# EAGLE design iv4_6lw_1.0 (EAGLE 5.07)
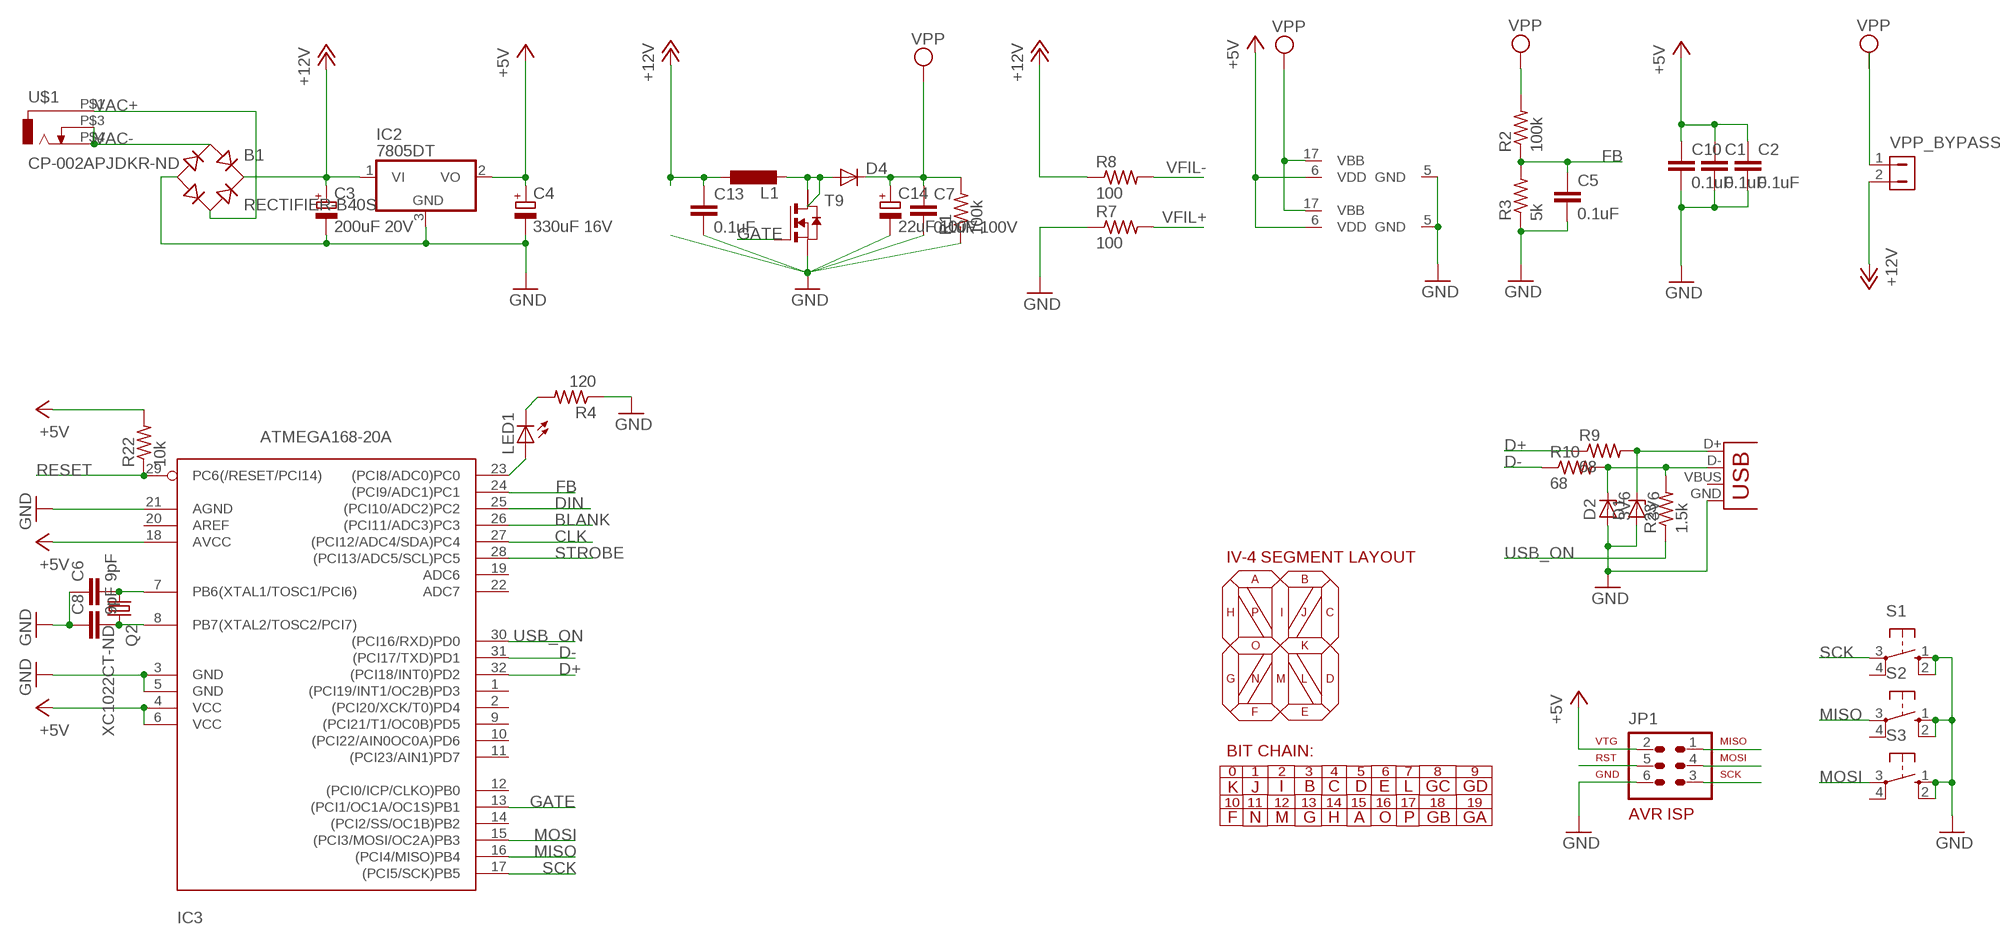
[diagram p0: schematic, sheet 1]

## Parts
B1  RECTIFIER-B40S  [B40S]
C1  0.1uF  C-EUC0805  [C0805]
C2  0.1uF  C-EUC0805  [C0805]
C3  200uF 20V  CPOL-EUUD-10X10  [UD-10X10_NICHICON]
C4  330uF 16V  CPOL-EUUD-10X10  [UD-10X10_NICHICON]
C5  0.1uF  C-EUC0805  [C0805]
C6  9pF  C-EUC0805  [C0805]
C7  0.1uF 100V  C-EUC1206  [C1206]
C8  9pF  C-EUC0805  [C0805]
C10  0.1uF  C-EUC0805  [C0805]
C13  0.1uF  C-EUC0805  [C0805]
C14  22uF 100V  CPOL-EUUD-10X10  [UD-10X10_NICHICON]
D1  3V6  ZENER-DIODESOD80C  [SOD80C]
D2  3V6  ZENER-DIODESOD80C  [SOD80C]
D4  DIODE-DO214AA  [DO214AA]
IC2  7805DT  [TO252]
IC3  ATMEGA168-20A  [TQFP32-08]
JP1  AVR-ISP-6  [AVR-ISP-6]
L1  DO3316P  [DO3316P]
LED1  LEDCHIPLED_1206  [CHIPLED_1206]
Q2  XC1022CT-ND  CRYSTALHC49S  [HC49/S]
R1  100k  R-US_R0805  [R0805]
R2  100k  R-US_R0805  [R0805]
R3  5k  R-US_R0805  [R0805]
R4  120  R-US_R0805  [R0805]
R7  100  R-US_0207/7  [0207/7]
R8  100  R-US_0207/7  [0207/7]
R9  68  R-US_R0805  [R0805]
R10  68  R-US_R0805  [R0805]
R22  10k  R-US_R0805  [R0805]
R23  1.5k  R-US_R0805  [R0805]
S1  10-XX  [B3F-10XX]
S2  10-XX  [B3F-10XX]
S3  10-XX  [B3F-10XX]
T9  NMOSSOT223  [SOT223]
U$1  CP-002APJDKR-ND  PJ002A-SMT  [PJ002A-SMT]
U$3  A6810-LW  [SO20W]
U$4  A6810-LW  [SO20W]
VPP_BYPASS  HDR-1X2-SIP-100  [SIP-100-2V]
X1  USBSMD  [USB-MINIB]

## Nets
+5V: C1.1 C2.1 C4.+ C10.1 IC2.2(VO) IC3.4(VCC) IC3.6(VCC) IC3.18(AVCC) JP1.2 R22.2 U$3.6(VDD) U$4.6(VDD)
+12V: B1.+ C3.+ C13.1 IC2.1(VI) L1.2 R8.1 VPP_BYPASS.2
BLANK: IC3.26((PCI11/ADC3)PC3)
CLK: IC3.27((PCI12/ADC4/SDA)PC4)
D+: IC3.32((PCI18/INT0)PD2) R9.1
D-: IC3.31((PCI17/TXD)PD1) R10.1
DIN: IC3.25((PCI10/ADC2)PC2)
FB: C5.1 IC3.24((PCI9/ADC1)PC1) R2.1 R3.2
GATE: IC3.13((PCI1/OC1A/OC1S)PB1) T9.1(G)
GND: B1.- C1.2 C2.2 C3.- C4.- C5.2 C6.1 C7.2 C8.1 C10.2 C13.2 C14.- D1.A D2.A IC2.3(GND) IC3.3(GND) IC3.5(GND) IC3.21(AGND) JP1.6 R1.1 R3.1 R4.1 R7.1 S1.1(S) S1.2(S1) S2.1(S) S2.2(S1) S3.1(S) S3.2(S1) T9.3(S) U$3.5(GND) U$4.5(GND) X1.GND
MISO: IC3.16((PCI4/MISO)PB4) JP1.1 S2.3(P)
MOSI: IC3.15((PCI3/MOSI/OC2A)PB3) JP1.4 S3.3(P)
N$1: D4.A L1.1 T9.2(D) T9.4(D2)
N$2: C6.2 IC3.7(PB6(XTAL1/TOSC1/PCI6)) Q2.1
N$3: C8.2 IC3.8(PB7(XTAL2/TOSC2/PCI7)) Q2.2
N$4: D2.C R10.2 R23.2 X1.D-
N$5: D1.C R9.2 X1.D+
N$7: LED1.C R4.2
N$8: IC3.23((PCI8/ADC0)PC0) LED1.A
RESET: IC3.29(PC6(/RESET/PCI14)) JP1.5 R22.1
SCK: IC3.17((PCI5/SCK)PB5) JP1.3 S1.3(P)
STROBE: IC3.28((PCI13/ADC5/SCL)PC5)
USB_ON: IC3.30((PCI16/RXD)PD0) R23.1
VAC+: B1.AC2 U$1.P$1
VAC-: B1.AC1 U$1.P$3 U$1.P$4
VFIL+: R7.2
VFIL-: R8.2
VPP: C7.1 C14.+ D4.C R1.2 R2.2 U$3.17(VBB) U$4.17(VBB) VPP_BYPASS.1
Unconnected: IC3.1((PCI19/INT1/OC2B)PD3) IC3.2((PCI20/XCK/T0)PD4) IC3.9((PCI21/T1/OC0B)PD5) IC3.10((PCI22/AIN0OC0A)PD6) IC3.11((PCI23/AIN1)PD7) IC3.12((PCI0/ICP/CLKO)PB0) IC3.14((PCI2/SS/OC1B)PB2) IC3.19(ADC6) IC3.20(AREF) IC3.22(ADC7) S1.4(P1) S2.4(P1) S3.4(P1) U$3.1(OUT8) U$3.2(OUT7) U$3.3(OUT6) U$3.4(CLK) U$3.7(STROBE) U$3.8(OUT5) U$3.9(OUT4) U$3.12(OUT3) U$3.13(OUT2) U$3.14(OUT1) U$3.15(BLANK) U$3.16(DIN) U$3.18(DOUT) U$3.19(OUT10) U$3.20(OUT9) U$4.1(OUT8) U$4.2(OUT7) U$4.3(OUT6) U$4.4(CLK) U$4.7(STROBE) U$4.8(OUT5) U$4.9(OUT4) U$4.12(OUT3) U$4.13(OUT2) U$4.14(OUT1) U$4.15(BLANK) U$4.16(DIN) U$4.18(DOUT) U$4.19(OUT10) U$4.20(OUT9) X1.VBUS

## Notes on the sheet
- IV-4 SEGMENT LAYOUT
- A | B
- H | P | I | J | C
- O | K
- G | N | M | L | D
- F | E
- BIT CHAIN:
- 0 | 1 | 2 | 3 | 4 | 5 | 6 | 7 | 8 | 9
- K | J | I | B | C | D | E | L | GC | GD
- 10 | 11 | 12 | 13 | 14 | 15 | 16 | 17 | 18 | 19
- F | N | M | G | H | A | O | P | GB | GA

## Library data of the parts
B1 = rectifier:RECTIFIER-: Rectifier
C1 C2 C5-C8 C10 C13 = rcl:C-EU: CAPACITOR, European symbol
C3 C4 C14 = rcl:CPOL-EU: POLARIZED CAPACITOR, European symbol
D1 D2 = diode:ZENER-DIODE: Z-Diode
D4 = diode:DIODE-: DIODE
IC2 = linear:78*: Positive VOLTAGE REGULATOR Source: http://cache.national.com/ds/LM/LM78L05.pdf http://www.fairchildsemi.com/ds/LM/LM7805.pdf
IC3 = avr:ATMEGA168: MICROCONTROLLER 16 kBytes FLASH 1 kBytes SRAM 512 Bytes EEPROM USART 8-channel 10 bit ADC
JP1 = atmel:AVR-ISP-6: AVR ISP-6 Serial Programming Header
L1 = inductor-coilcraft:DO3316P: COILCRAFT
LED1 = adafruit:LED: LED OSRAM: - CHIPLED LG R971, LG N971, LY N971, LG Q971, LY Q971, LO R971, LY R971 LH N974, LH R974 LS Q976, LO Q976, LY Q976 LO Q996 - Hyper CHIPLED LW Q18S LB Q993, LB Q99A, LB R99A - SideLED LS A670, LO A670, LY A670, LG A670, LP A670 LB A673, LV A673, LT A673, LW A673 LH A674 LY A675 LS A676, LA A676, LO A676, LY A676, LW A676 LS A679, LY A679, LG A679 - Hyper Micro SIDELED® LS Y876, LA Y876, LO Y876, LY Y876 LT Y87S - SmartLED LW L88C, LW L88S LB L89C, LB L89S, LG L890 LS L89K, LO L89K, LY L89K LS L896, LA L896, LO L896, LY L896 - TOPLED LS T670, LO T670, LY T670, LG T670, LP T670 LSG T670, LSP T670, LSY T670, LOP T670, LYG T670 LG T671, LOG T671, LSG T671 LB T673, LV T673, LT T673, LW T673 LH T674 LS T676, LA T676, LO T676, LY T676, LB T676, LH T676, LSB T676, LW T676 LB T67C, LV T67C, LT T67C, LS T67K, LO T67K, LY T67K, LW E67C LS E67B, LA E67B, LO E67B, LY E67B, LB E67C, LV E67C, LT E67C LW T67C LS T679, LY T679, LG T679 LS T770, LO T770, LY T770, LG T770, LP T770 LB T773, LV T773, LT T773, LW T773 LH T774 LS E675, LA E675, LY E675, LS T675 LS T776, LA T776, LO T776, LY T776, LB T776 LHGB T686 LT T68C, LB T68C - Hyper Mini TOPLED® LB M676 - Mini TOPLED Santana® LG M470 LS M47K, LO M47K, LY M47K Source: http://www.osram.convergy.de/
Q2 = crystal:CRYSTAL: CRYSTAL
R1-R4 R7-R10 R22 R23 = rcl:R-US_: RESISTOR, American symbol
S1-S3 = switch-omron:10-XX: OMRON SWITCH
T9 = zetex:NMOSSOT223: MOS FET
U$1 = con-jack:PJ002A-SMT
U$3 U$4 = allegro:A6810-LW
VPP_BYPASS = con-hdrs40:HDR-1X2: HEADER CONNECTOR
X1 = SparkFun:USB: USB Connectors USB-B-PTH is fully proven SKU : PRT-00139 USB-miniB is fully proven SKU : PRT-00587 USB-A-PCB is untested. USB-A-H is throughly reviewed, but untested. Spark Fun Electronics SKU : PRT-00437 USB-B-SMT is throughly reviewed, but untested. Needs silkscreen touching up. USB-A-S has not been used/tested USB-MB-H has not been used/tested

## Board
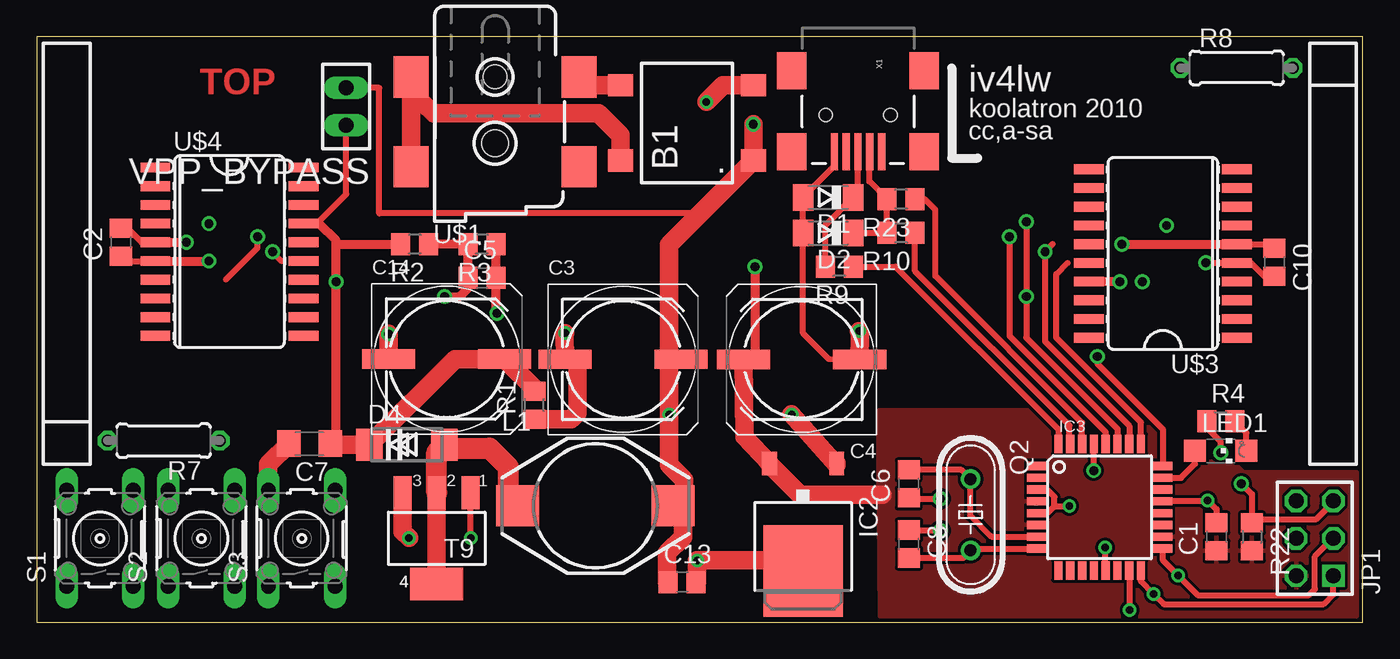
[diagram p1: board, top side]
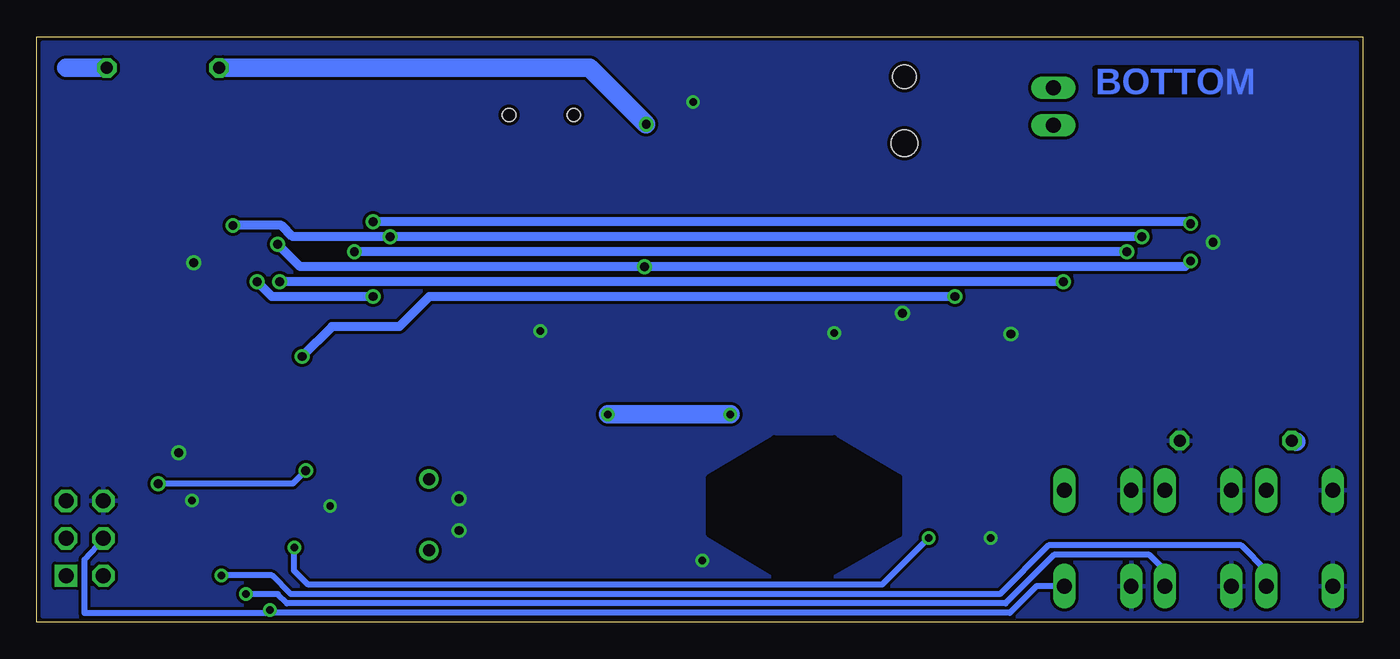
[diagram p2: board, bottom side, seen from below]

Size 90.02 x 39.73 mm. Coordinates in mm from the lower left corner, seen from the top.
Outline: 0,0 90.02,0 90.02,39.73 0,39.73 0,0
Copper layers (1*16): Top 0.035mm / dielectric 1.5mm / Bottom 0.035mm
Design rules "default *": minimum track width 8mil, minimum drill 20mil, track to track 8mil, track to pad 8mil, pad to pad 8mil, via to via 8mil, smd to smd 8mil, copper to edge 10mil, drill to drill 8mil, minimum pad ring 10mil, minimum via ring 8mil, stop-mask expansion 4mil, vias tented up to drill 0mil, thermal gap 8mil
bRestrict: area 31.5,3.3 to 44.4,12.5

### Footprints (pad centres in the part's own frame; a part is rotated, then mirrored left to right if it is on the bottom)
B40S = smd 1.5 x 1.7: + -2.55,-4.5; - 2.55,-4.5; AC1 -2.55,4.5; AC2 2.55,4.5
C0805 = smd 1.3 x 1.5: 1 -0.95,0; 2 0.95,0
UD-10X10_NICHICON = smd 3.6 x 1.3: + 3.925,0; - -3.95,0
C1206 = smd 1.6 x 1.8: 1 -1.4,0; 2 1.4,0
SOD80C = smd 1.4 x 1.8: A 1.7,0; C -1.7,0
DO214AA = smd 1.8 x 2.2: A 2.55,0; C -2.55,0
TO252 = smd 1 x 1.6: 1 -2.28,-4.8; 2 2.28,-4.8 | smd 5.4 x 6.2: 3 0,2.5
TQFP32-08 = smd 1.27 x 0.559: 1 -4.293,2.8; 2 -4.293,2; 3 -4.293,1.2; 4 -4.293,0.4; 5 -4.293,-0.4; 6 -4.293,-1.2; 7 -4.293,-2; 8 -4.293,-2.8; 17 4.293,-2.8; 18 4.293,-2; 19 4.293,-1.2; 20 4.293,-0.4; 21 4.293,0.4; 22 4.293,1.2; 23 4.293,2; 24 4.293,2.8 | smd 0.559 x 1.27: 9 -2.8,-4.293; 10 -2,-4.293; 11 -1.2,-4.293; 12 -0.4,-4.293; 13 0.4,-4.293; 14 1.2,-4.293; 15 2,-4.293; 16 2.8,-4.293; 25 2.8,4.293; 26 2,4.293; 27 1.2,4.293; 28 0.4,4.293; 29 -0.4,4.293; 30 -1.2,4.293; 31 -2,4.293; 32 -2.8,4.293
AVR-ISP-6 = drill 1.016 square: 1 -2.54,-1.27 | drill 1.016 octagon: 2 -2.54,1.27; 3 0,-1.27; 4 0,1.27; 5 2.54,-1.27; 6 2.54,1.27
DO3316P = smd 2.92 x 2.79: 1 -5.28,0; 2 5.28,0
CHIPLED_1206 = smd 1.5 x 1.5: A 0,-1.75; C 0,1.75
HC49/S = drill 0.813 round: 1 -2.413,0; 2 2.413,0
R0805 = smd 1.3 x 1.5: 1 -0.95,0; 2 0.95,0
0207/7 = drill 0.813 octagon: 1 -3.81,0; 2 3.81,0
B3F-10XX = drill 1.016 long: 1 -3.251,2.261; 2 3.251,2.261; 3 -3.251,-2.261; 4 3.251,-2.261
SOT223 = smd 1.219 x 2.235: 1 -2.311,-3.099; 2 0,-3.099; 3 2.311,-3.099 | smd 3.6 x 2.2: 4 0,3.099
PJ002A-SMT = smd 2.4 x 2.8: P$1 5.7,6.4; P$2 5.7,0.3; P$3 -5.7,6.4; P$4 -5.7,0.3 | hole 1.6: 0,6.4 | hole 1.8: 0,1.9
SO20W = smd 0.66 x 2.032: 1 -5.715,-5.029; 2 -4.445,-5.029; 3 -3.175,-5.029; 4 -1.905,-5.029; 5 -0.635,-5.029; 6 0.635,-5.029; 7 1.905,-5.029; 8 3.175,-5.029; 9 4.445,-5.029; 10 5.715,-5.029; 11 5.715,5.029; 12 4.445,5.029; 13 3.175,5.029; 14 1.905,5.029; 15 0.635,5.029; 16 -0.635,5.029; 17 -1.905,5.029; 18 -3.175,5.029; 19 -4.445,5.029; 20 -5.715,5.029
SIP-100-2V = drill 1.016 long: 1 -1.27,0; 2 1.27,0
USB-MINIB = smd 2.5 x 0.5: D+ 2.5,0; D- 2.5,0.8; GND 2.5,-1.6; ID 2.5,-0.8; VBUS 2.5,1.6 | smd 2.5 x 2: GND@1 -3,-4.5; GND@2 -3,4.5; GND@3 2.5,4.5; GND@4 2.5,-4.5 | hole 0.9: 0,2.2; 0,-2.2

### Placement (x,y rotation side)
B1  44.15,33.88 90 top
C1  80.09,5.79 90 top
C2  5.72,25.78 90 top
C3  39.8,17.84 0 top
C4  51.92,17.83 180 top
C5  30.23,23.37 0 top
C6  59.2,9.38 90 top
C7  18.52,12.12 180 top
C8  59.21,5.31 270 top
C10  84.02,24.44 270 top
C13  43.82,2.72 0 top
C14  27.84,17.86 0 top
D1  53.72,28.83 180 top
D2  53.72,26.42 180 top
D4  25.12,12.04 0 top
IC2  52.02,5.97 180 top
IC3  72.16,7.8 0 top
JP1  86.77,5.69 90 top
L1  37.92,7.9 0 top
LED1  80.38,11.63 270 top
Q2  63.4,7.29 270 top
R1  33.78,14.73 90 top
R2  25.65,25.65 180 top
R3  30.23,25.65 180 top
R4  80.38,13.63 0 top
R7  8.61,12.32 180 top
R8  81.46,37.62 0 top
R9  54.48,24.13 180 top
R10  58.67,26.42 180 top
R22  82.5,5.79 270 top
R23  58.67,28.7 180 top
S1  4.29,5.69 90 top
S2  11.18,5.69 90 top
S3  17.98,5.69 90 top
T9  27.15,5.69 180 top
U$1  31.12,30.61 0 top
U$3  76.45,25.02 90 top
U$4  13.08,25.15 270 top
VPP_BYPASS  21,35 90 top
X1  55.75,34.42 270 top

### Tracks (layer width: path | path; a pad name or v marks a point on that pad's centre or on a via)
+5V  (via drill 0.6)
  Top 0.406: C2.1 5.65,24.51 U$4.6 | U$3.6 82.04,25.65 83.78,25.65 C10.1
  Top 0.61: U$4.6 v11.68,24.51 | v73.66,25.65 82.04,25.65 | v48.77,24.13 48.77,17.96 C4.+
  Top 1.27: 57.4,8.64 51.82,8.64 49.74,10.71 IC2.2 48.04,12.59 C4.+
  Bottom 0.61: v11.68,24.51 12.07,24.13 v48.77,24.13 72.14,24.13 v73.66,25.65
  pour Top: 57.23,0.41 89.61,0.41 89.61,10.16 81.92,10.16 77.7,14.38 57.1,14.38
+12V  (via drill 0.51, 0.6)
  Top 0.406: VPP_BYPASS.2 23.25,36.27 23.25,27.75 44.91,27.75 44.91,27.59
  Top 1.27: L1.2 43.88,7.9 43.88,7.37 | 43.88,7.37 43.88,5.78 42.8,4.7 42.8,2.72 C13.1 | 42.93,17.77 v42.93,14.1 42.93,10.67 43.94,9.65 43.94,7.43 43.88,7.37 | 42.93,17.77 C3.+ | IC2.1 54.3,10.67 v51.25,14.1 | 42.93,17.77 42.93,17.27 42.93,25.61 44.91,27.59 B1.+ v48.64,33.78
  Bottom 0.406: v48.64,33.78 48.42,34
  Bottom 1.27: v42.93,14.1 v51.25,14.1 | R8.1 52.48,37.62 v48.64,33.78
BLANK  (via drill 0.6)
  Top 0.406: v16,25.15 16.64,24.51 | 68.96,25.65 v68.45,25.15 68.45,19.05 74.16,13.34 IC3.26
  Bottom 0.61: v16,25.15 v68.45,25.15
CLK  (via drill 0.6)
  Top 0.406: IC3.27 73.36,13.13 67.18,19.3 v67.18,22.1 v67.18,27.18
  Bottom 0.61: v67.18,22.1 74.04,22.1 v75.06,23.11 | v67.18,27.18 11.81,27.18 v11.68,27.05
D+
  Top 0.406: R9.1 58.31,24.13 69.34,13.1 69.34,12.11 IC3.32
D-
  Top 0.406: R10.1 59.62,23.83 70.1,13.35 70.1,12.15 IC3.31
DIN
  Top 0.406: 69.98,24.38 69.22,23.62 69.22,19.3 74.96,13.56 IC3.25
FB  (via drill 0.6)
  Top 0.406: v72.01,18.03 72.01,17.53 76.45,13.08 IC3.24
  Top 0.61: R2.1 R3.2 C5.1 29.28,22.67 28.7,22.1 v27.69,22.1
  Bottom 0.61: v27.69,22.1 63.37,22.1 65.41,20.07 69.98,20.07 v72.01,18.03
GATE  (via drill 0.51)
  Top 0.406: v29.46,5.72 T9.1 | v72.52,5.08 72.52,3.55 IC3.13
  Bottom 0.406: v29.46,5.72 32.64,2.54 71.6,2.54 IC3.13 72.56,5.04 v72.52,5.08
GND  (via drill 0.51, 0.6)
  Top 0.406: 80.12,6.76 80.16,6.76 | IC3.21 76.49,8.23 76.49,8.26 v79.5,8.26 80.09,7.67 C1.2 80.14,6.79 | 67.87,7.37 IC3.5 68.61,7.4 69.09,7.87 | 69.09,7.87 v70.1,7.87 | IC3.3 68.6,9 69.09,8.51 69.09,7.87 | v79.38,24.38 U$3.5 82.42,24.38 83.44,23.37 83.91,23.37 C10.2 | U$4.5 7.11,25.78 6.22,26.67 5.78,26.67 C2.2 | C6.1 59.25,8.38 v61.34,8.38 | C8.1 59.24,6.22 v61.34,6.22 | X1.GND 54.15,30.96 D1.A D2.A 52.02,19.6 53.75,17.88 C4.- | R4.1 79.43,13.2 80.38,12.25 v80.38,11.5
  Top 0.61: U$4.5 v10.16,25.78 | R3.1 C5.2 31.18,21.02 v31.24,20.96
  Top 0.813: C1.2 80.12,6.76
  Top 1.27: T9.3 24.84,6.15 v25.27,5.72 | v35.87,19.62 35.84,19.59 C3.- 36.7,17.86 36.7,14.22 36.26,13.78 R1.1 | C13.2 44.83,2.72 v44.83,4.19 52.02,4.19 IC2.3 | C4.- 55.88,19.5 v55.82,19.75 | B1.- 46.59,36.43 v45.47,35.31 | C7.2 15.72,10.72 S3.2 | C14.- v23.89,19.56
  pour Bottom: 89.61,0.41 0.41,0.41 0.41,39.32 89.61,39.32
MISO  (via drill 0.51 pad 0.2)
  Top 0.406: JP1.1 88.04,1.88 87.38,1.22 76.51,1.22 v75.82,1.91 74.96,2.76 IC3.16
  Bottom 0.406: S2.3 13.44,3.53 14.48,4.57 20.96,4.57 24.26,1.27 73.03,1.27 73.66,1.91 v75.82,1.91
MOSI  (via drill 0.51)
  Top 0.406: v74.19,0.81 74.19,2.65 IC3.15
  Bottom 0.406: JP1.4 85.5,5.64 86.77,4.27 86.77,0.61 74.19,0.61 v74.19,0.81 74.02,0.64 23.95,0.64 22.15,2.44 S3.3
N$1
  Top 1.27: T9.4 T9.2 | 32,7.24 32.64,7.88 L1.1
  Top 1.422: 32,7.24 32,10.54 30.73,11.81 27.9,11.81 D4.A 27.15,11.52 T9.2
N$2
  Top 0.406: C6.2 62.77,10.33 Q2.1 63.37,9.68 63.37,7.24 64.81,5.8 IC3.7
N$3
  Top 0.406: C8.2 62.88,4.36 Q2.2 63.52,5 IC3.8
N$4
  Top 0.406: X1.D- 56.52,31.88 56.52,29.91 R23.2 | R23.2 57.72,29.02 | R23.2 R10.2 D2.C
N$5
  Top 0.406: D1.C 55.42,29.42 | R9.2 53.53,26.94 D1.C | X1.D+ 55.75,29.16 D1.C
N$7
  Top 0.406: LED1.C 82.13,12.83 R4.2
N$8
  Top 0.406: IC3.23 77.67,9.8 78.63,10.75 LED1.A
RESET  (via drill 0.6)
  Top 0.406: JP1.5 88.04,8.15 86.87,6.99 82.85,6.99 R22.1 82.5,8.69 v81.79,9.4 | v71.76,10.29 IC3.29
  Bottom 0.406: v81.79,9.4 72.64,9.4 v71.76,10.29
SCK  (via drill 0.51 pad 0.2)
  Top 0.406: JP1.3 87.99,5.69 86.77,4.47 86.77,2.24 86.36,1.83 78.82,1.83 v77.47,3.18 76.45,4.19 IC3.17 | IC3.17 76.02,4.97 | IC3.17 76.27,5
  Bottom 0.406: S1.3 6.55,3.51 8.26,5.21 21.34,5.21 24.64,1.91 72.77,1.91 74.04,3.18 v77.47,3.18
STROBE  (via drill 0.6)
  Top 0.406: IC3.28 72.56,12.91 66.04,19.43 v66.04,26.16 | v14.99,26.16 14.99,25.4 12.83,23.24
  Bottom 0.61: v76.71,26.92 73.41,26.92 72.64,26.16 v66.04,26.16 v14.99,26.16
USB_ON
  Top 0.406: R23.1 60.3,28.7 61,28 61,23.5 70.96,13.54 IC3.30
VAC+
  Top 1.27: B1.AC2 37.39,36.43 U$1.P$1
VAC-
  Top 1.27: B1.AC1 39.65,33.04 38.14,34.54 26.92,34.54 25.42,36 | 25.4,33.02 25.4,30.92 U$1.P$4 25.42,36 | 25.42,36 U$1.P$3
VFIL+
  Bottom 1.27: R7.2 4.5,12.24
VFIL-
  Bottom 1.016: R8.2 85.42,37.64
  Bottom 1.27: R8.2 88.01,37.62
VPP  (via drill 0.6)
  Top 0.406: VPP_BYPASS.1 21,29.05 19,27.05
  Top 0.61: 29.34,17.86 29.08,18.11 | U$4.17 19,27.05 19.18,27.05 20.32,25.91 20.32,25.53 | 20.32,25.53 v20.32,23.11 20.32,12.52 C7.1 | v73.53,23.11 U$3.17 | R2.2 20.45,25.65 20.32,25.53
  Top 1.27: R1.2 33.78,15.84 C14.+ 29.34,17.86 28.39,17.86 D4.C 19.99,12.04 C7.1
  Bottom 0.61: v20.32,23.11 v73.53,23.11

### Text on the board
Top: TOP
Bottom: BOTTOM
_tplace: iv4lw | koolatron 2010 | cc,a-sa | . | 4